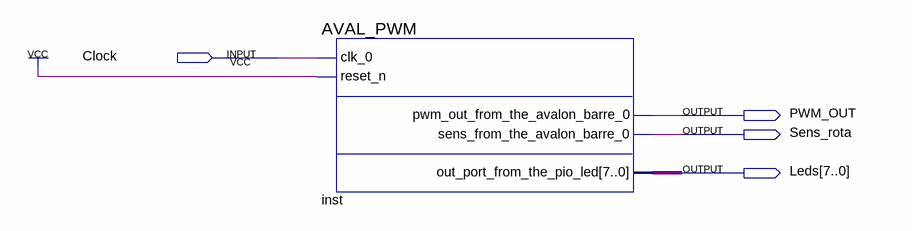
[diagram p0: schematic sheet]
// Quartus schematic Cmd_pwm.bdf as structural Verilog: 1 symbols, 4 pins
module Cmd_pwm (
  input  Clock,
  output PWM_OUT,
  output Sens_rota,
  output [7:0] Leds
);

  AVAL_PWM inst (
    .clk_0(Clock), .reset_n(1'b1), .pwm_out_from_the_avalon_barre_0(PWM_OUT),
    .sens_from_the_avalon_barre_0(Sens_rota), .out_port_from_the_pio_led(Leds));
endmodule
